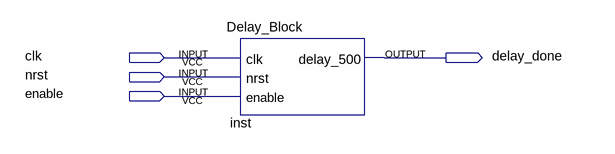
[diagram p0: schematic sheet]
// Quartus schematic Delay_Block_test.bdf as structural Verilog: 1 symbols, 4 pins
module Delay_Block_test (
  input  clk,
  input  nrst,
  input  enable,
  output delay_done
);

  Delay_Block inst (.clk(clk), .nrst(nrst), .enable(enable), .delay_500(delay_done));
endmodule
